# EAGLE schematic omnibus_proto (EAGLE 6.6.0)
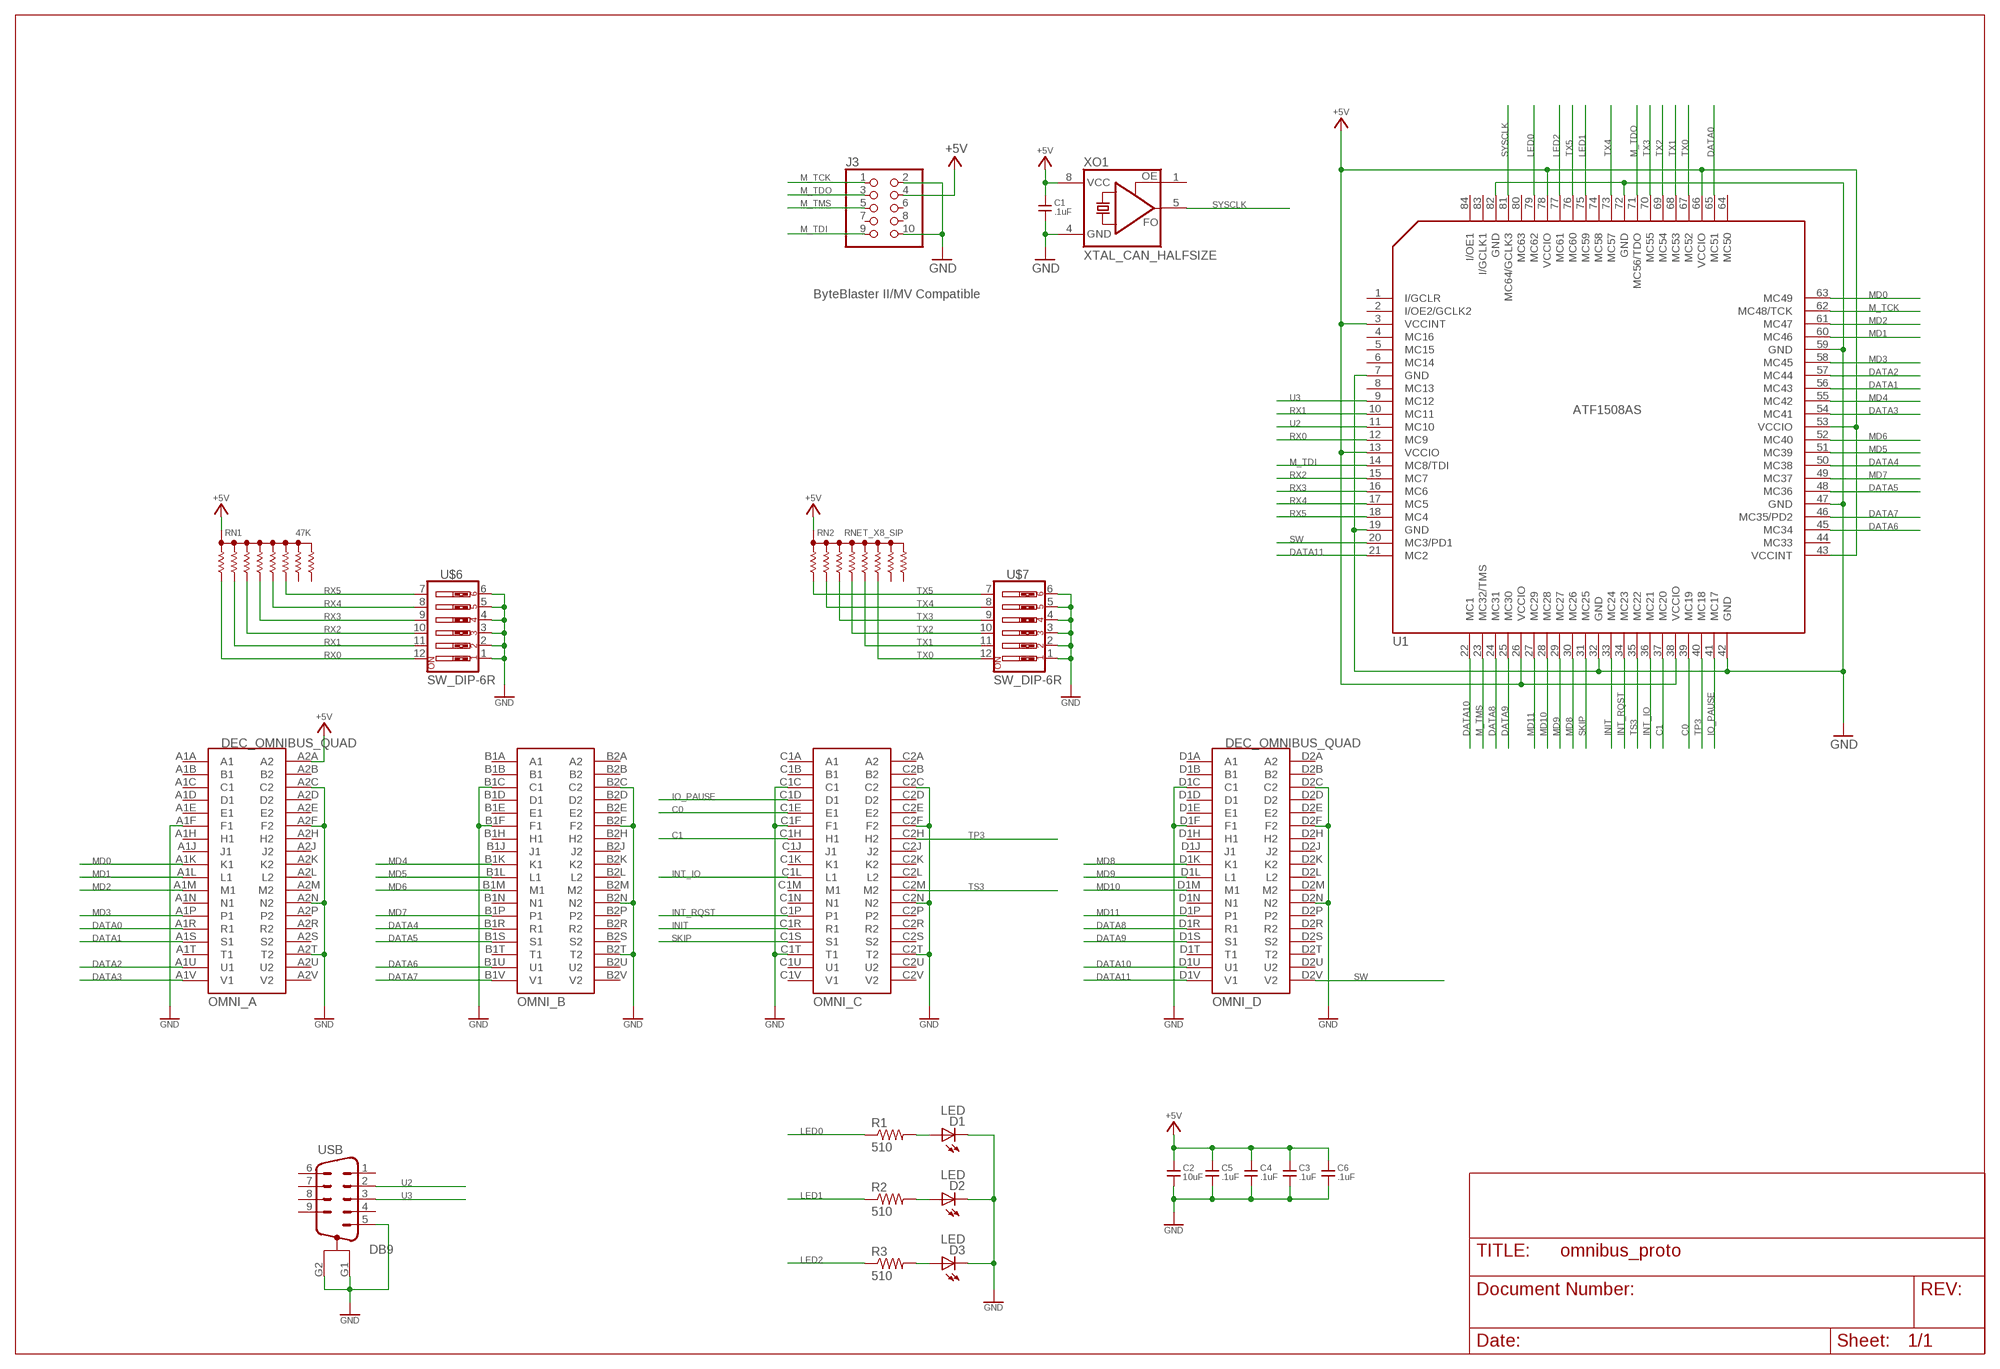
[diagram p0: schematic, sheet 1]

## Parts
C1  .1uF  C_US  [C_TH_5MM]
C2  10uF  C_US  [C_TH_5MM]
C3  .1uF  C_US  [C_TH_5MM]
C4  .1uF  C_US  [C_TH_5MM]
C5  .1uF  C_US  [C_TH_5MM]
C6  .1uF  C_US  [C_TH_5MM]
D1  LED  [LED_TH_3MM]
D2  LED  [LED_TH_3MM]
D3  LED  [LED_TH_3MM]
J3  HDR_2X5"  [HDR_2X5]
OMNI  DEC_OMNIBUS_QUAD  [DEC_OMNIBUS_QUAD]
R1  510  R_US  [R_204/7]
R2  510  R_US  [R_204/7]
R3  510  R_US  [R_204/7]
RN1  47K  RNET_X8_SIP  [RN_SIP9]
RN2  RNET_X8_SIP  [RN_SIP9]
U1  ATF1508AS  ATF1504AS_PLCC  [PLCC84]
U$6  SW_DIP-6R  [SW_DIP-6_ROUND]
U$7  SW_DIP-6R  [SW_DIP-6_ROUND]
USB  DB9  [AMP_DB-9RA]
XO1  XTAL_CAN_HALFSIZE  [XTAL_CAN_HALFSIZE]

## Nets
+5V: C1.1 C2.1 C3.1 C4.1 C5.1 C6.1 J3.4 OMNI.A2A(_A:A2) RN1.1 RN2.1 U1.3(VCCINT) U1.13(VCCIO) U1.26(VCCIO) U1.38(VCCIO) U1.43(VCCINT) U1.53(VCCIO) U1.66(VCCIO) U1.78(VCCIO) XO1.8(VCC)
C0: OMNI.C1E(_C:E1) U1.39(MC19)
C1: OMNI.C1H(_C:H1) U1.37(MC20)
DATA0: OMNI.A1R(_A:R1) U1.65(MC51)
DATA1: OMNI.A1S(_A:S1) U1.56(MC43)
DATA2: OMNI.A1U(_A:U1) U1.57(MC44)
DATA3: OMNI.A1V(_A:V1) U1.54(MC41)
DATA4: OMNI.B1R(_B:R1) U1.50(MC38)
DATA5: OMNI.B1S(_B:S1) U1.48(MC36)
DATA6: OMNI.B1U(_B:U1) U1.45(MC34)
DATA7: OMNI.B1V(_B:V1) U1.46(MC35/PD2)
DATA8: OMNI.D1R(_D:R1) U1.24(MC31)
DATA9: OMNI.D1S(_D:S1) U1.25(MC30)
DATA10: OMNI.D1U(_D:U1) U1.22(MC1)
DATA11: OMNI.D1V(_D:V1) U1.21(MC2)
GND: C1.2 C2.2 C3.2 C4.2 C5.2 C6.2 D1.K(C) D2.K(C) D3.K(C) J3.2 J3.10 OMNI.A1F(_A:F1) OMNI.A2C(_A:C2) OMNI.A2F(_A:F2) OMNI.A2N(_A:N2) OMNI.A2T(_A:T2) OMNI.B1C(_B:C1) OMNI.B1F(_B:F1) OMNI.B2C(_B:C2) OMNI.B2F(_B:F2) OMNI.B2N(_B:N2) OMNI.B2T(_B:T2) OMNI.C1C(_C:C1) OMNI.C1F(_C:F1) OMNI.C1T(_C:T1) OMNI.C2C(_C:C2) OMNI.C2F(_C:F2) OMNI.C2N(_C:N2) OMNI.C2T(_C:T2) OMNI.D1C(_D:C1) OMNI.D1F(_D:F1) OMNI.D2C(_D:C2) OMNI.D2F(_D:F2) OMNI.D2N(_D:N2) U1.7(GND) U1.19(GND) U1.32(GND) U1.42(GND) U1.47(GND) U1.59(GND) U1.72(GND) U1.82(GND) U$6.1 U$6.2 U$6.3 U$6.4 U$6.5 U$6.6 U$7.1 U$7.2 U$7.3 U$7.4 U$7.5 U$7.6 USB.5 USB.G1 USB.G2 XO1.4(GND)
INIT: OMNI.C1R(_C:R1) U1.33(MC24)
INT_IO: OMNI.C1L(_C:L1) U1.36(MC21)
INT_RQST: OMNI.C1P(_C:P1) U1.34(MC23)
IO_PAUSE: OMNI.C1D(_C:D1) U1.41(MC17)
LED0: R1.1 U1.79(MC62)
LED1: R2.1 U1.75(MC59)
LED2: R3.1 U1.77(MC61)
M_TCK: J3.1 U1.62(MC48/TCK)
M_TDI: J3.9 U1.14(MC8/TDI)
M_TDO: J3.3 U1.71(MC56/TDO)
M_TMS: J3.5 U1.23(MC32/TMS)
MD0: OMNI.A1K(_A:K1) U1.63(MC49)
MD1: OMNI.A1L(_A:L1) U1.60(MC46)
MD2: OMNI.A1M(_A:M1) U1.61(MC47)
MD3: OMNI.A1P(_A:P1) U1.58(MC45)
MD4: OMNI.B1K(_B:K1) U1.55(MC42)
MD5: OMNI.B1L(_B:L1) U1.51(MC39)
MD6: OMNI.B1M(_B:M1) U1.52(MC40)
MD7: OMNI.B1P(_B:P1) U1.49(MC37)
MD8: OMNI.D1K(_D:K1) U1.30(MC26)
MD9: OMNI.D1L(_D:L1) U1.29(MC27)
MD10: OMNI.D1M(_D:M1) U1.28(MC28)
MD11: OMNI.D1P(_D:P1) U1.27(MC29)
N$2: D3.A R3.2
N$3: D2.A R2.2
N$4: D1.A R1.2
RX0: RN1.2 U1.12(MC9) U$6.12
RX1: RN1.3 U1.10(MC11) U$6.11
RX2: RN1.4 U1.15(MC7) U$6.10
RX3: RN1.5 U1.16(MC6) U$6.9
RX4: RN1.6 U1.17(MC5) U$6.8
RX5: RN1.7 U1.18(MC4) U$6.7
SKIP: OMNI.C1S(_C:S1) U1.31(MC25)
SW: OMNI.D2V(_D:V2) U1.20(MC3/PD1)
SYSCLK: U1.81(MC64/GCLK3) XO1.5(FO)
TP3: OMNI.C2H(_C:H2) U1.40(MC18)
TS3: OMNI.C2M(_C:M2) U1.35(MC22)
TX0: RN2.7 U1.67(MC52) U$7.12
TX1: RN2.6 U1.68(MC53) U$7.11
TX2: RN2.5 U1.69(MC54) U$7.10
TX3: RN2.4 U1.70(MC55) U$7.9
TX4: RN2.3 U1.73(MC57) U$7.8
TX5: RN2.2 U1.76(MC60) U$7.7
U2: U1.11(MC10) USB.2
U3: U1.9(MC12) USB.3
Unconnected: J3.6 J3.7 J3.8 OMNI.A1A(_A:A1) OMNI.A1B(_A:B1) OMNI.A1C(_A:C1) OMNI.A1D(_A:D1) OMNI.A1E(_A:E1) OMNI.A1H(_A:H1) OMNI.A1J(_A:J1) OMNI.A1N(_A:N1) OMNI.A1T(_A:T1) OMNI.A2B(_A:B2) OMNI.A2D(_A:D2) OMNI.A2E(_A:E2) OMNI.A2H(_A:H2) OMNI.A2J(_A:J2) OMNI.A2K(_A:K2) OMNI.A2L(_A:L2) OMNI.A2M(_A:M2) OMNI.A2P(_A:P2) OMNI.A2R(_A:R2) OMNI.A2S(_A:S2) OMNI.A2U(_A:U2) OMNI.A2V(_A:V2) OMNI.B1A(_B:A1) OMNI.B1B(_B:B1) OMNI.B1D(_B:D1) OMNI.B1E(_B:E1) OMNI.B1H(_B:H1) OMNI.B1J(_B:J1) OMNI.B1N(_B:N1) OMNI.B1T(_B:T1) OMNI.B2A(_B:A2) OMNI.B2B(_B:B2) OMNI.B2D(_B:D2) OMNI.B2E(_B:E2) OMNI.B2H(_B:H2) OMNI.B2J(_B:J2) OMNI.B2K(_B:K2) OMNI.B2L(_B:L2) OMNI.B2M(_B:M2) OMNI.B2P(_B:P2) OMNI.B2R(_B:R2) OMNI.B2S(_B:S2) OMNI.B2U(_B:U2) OMNI.B2V(_B:V2) OMNI.C1A(_C:A1) OMNI.C1B(_C:B1) OMNI.C1J(_C:J1) OMNI.C1K(_C:K1) OMNI.C1M(_C:M1) OMNI.C1N(_C:N1) OMNI.C1U(_C:U1) OMNI.C1V(_C:V1) OMNI.C2A(_C:A2) OMNI.C2B(_C:B2) OMNI.C2D(_C:D2) OMNI.C2E(_C:E2) OMNI.C2J(_C:J2) OMNI.C2K(_C:K2) OMNI.C2L(_C:L2) OMNI.C2P(_C:P2) OMNI.C2R(_C:R2) OMNI.C2S(_C:S2) OMNI.C2U(_C:U2) OMNI.C2V(_C:V2) OMNI.D1A(_D:A1) OMNI.D1B(_D:B1) OMNI.D1D(_D:D1) OMNI.D1E(_D:E1) OMNI.D1H(_D:H1) OMNI.D1J(_D:J1) OMNI.D1N(_D:N1) OMNI.D1T(_D:T1) OMNI.D2A(_D:A2) OMNI.D2B(_D:B2) OMNI.D2D(_D:D2) OMNI.D2E(_D:E2) OMNI.D2H(_D:H2) OMNI.D2J(_D:J2) OMNI.D2K(_D:K2) OMNI.D2L(_D:L2) OMNI.D2M(_D:M2) OMNI.D2P(_D:P2) OMNI.D2R(_D:R2) OMNI.D2S(_D:S2) OMNI.D2T(_D:T2) OMNI.D2U(_D:U2) RN1.8 RN1.9 RN2.8 RN2.9 U1.1(I/GCLR) U1.2(I/OE2/GCLK2) U1.4(MC16) U1.5(MC15) U1.6(MC14) U1.8(MC13) U1.44(MC33) U1.64(MC50) U1.74(MC58) U1.80(MC63) U1.83(I/GCLK1) U1.84(I/OE1) USB.1 USB.4 USB.6 USB.7 USB.8 USB.9 XO1.1(OE)

## Notes on the sheet
- ByteBlaster II/MV Compatible

## Library data of the parts
C1-C6 = alan_common:C_US: MLCC Ceramic cap
D1-D3 = alan_common:LED
J3 = alan_common:HDR_2X5: 0.254mm (100 mil) breakaway header - 2 x 5
OMNI = alan_common:DEC_OMNIBUS_QUAD
R1-R3 = alan_common:R_US
RN1 RN2 = alan_common:RNET_X8_SIP
U1 = alan_common:ATF1504AS: Atmel ATF1504 CPLD
U$6 U$7 = alan_common:SW_DIP-6
USB = alan_common:DB9; MANF: TE/AMP; MANF#: 1734352-1; MOUSER#: 571-1734352-1
XO1 = alan_common:XTAL_CAN_HALFSIZE